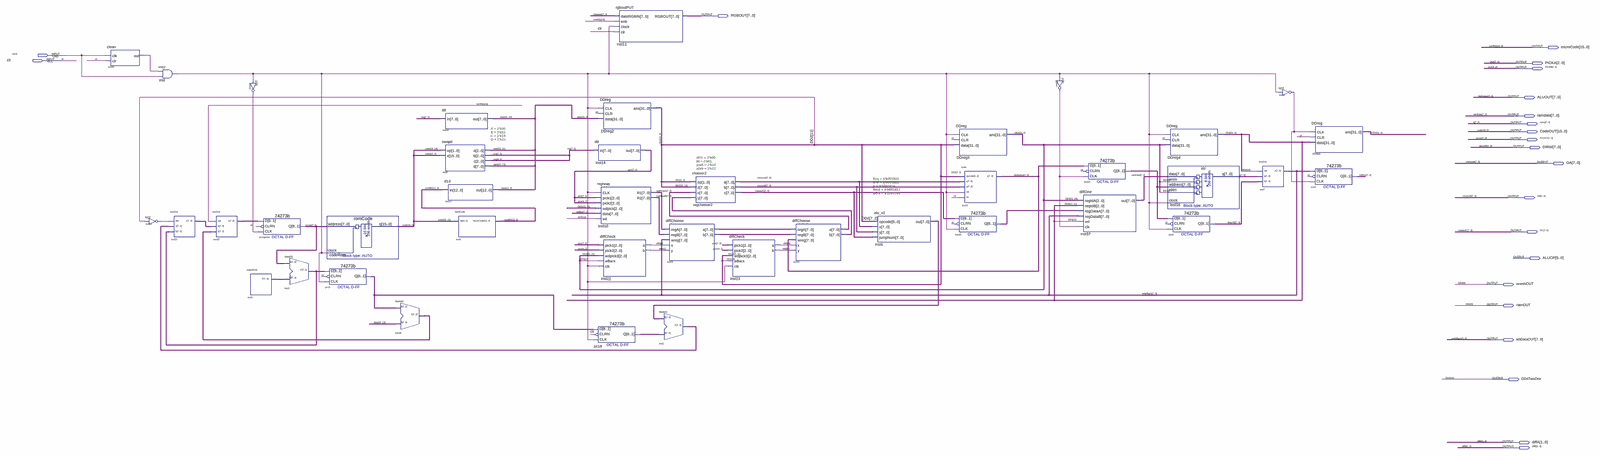
[diagram p0: schematic sheet, whole]
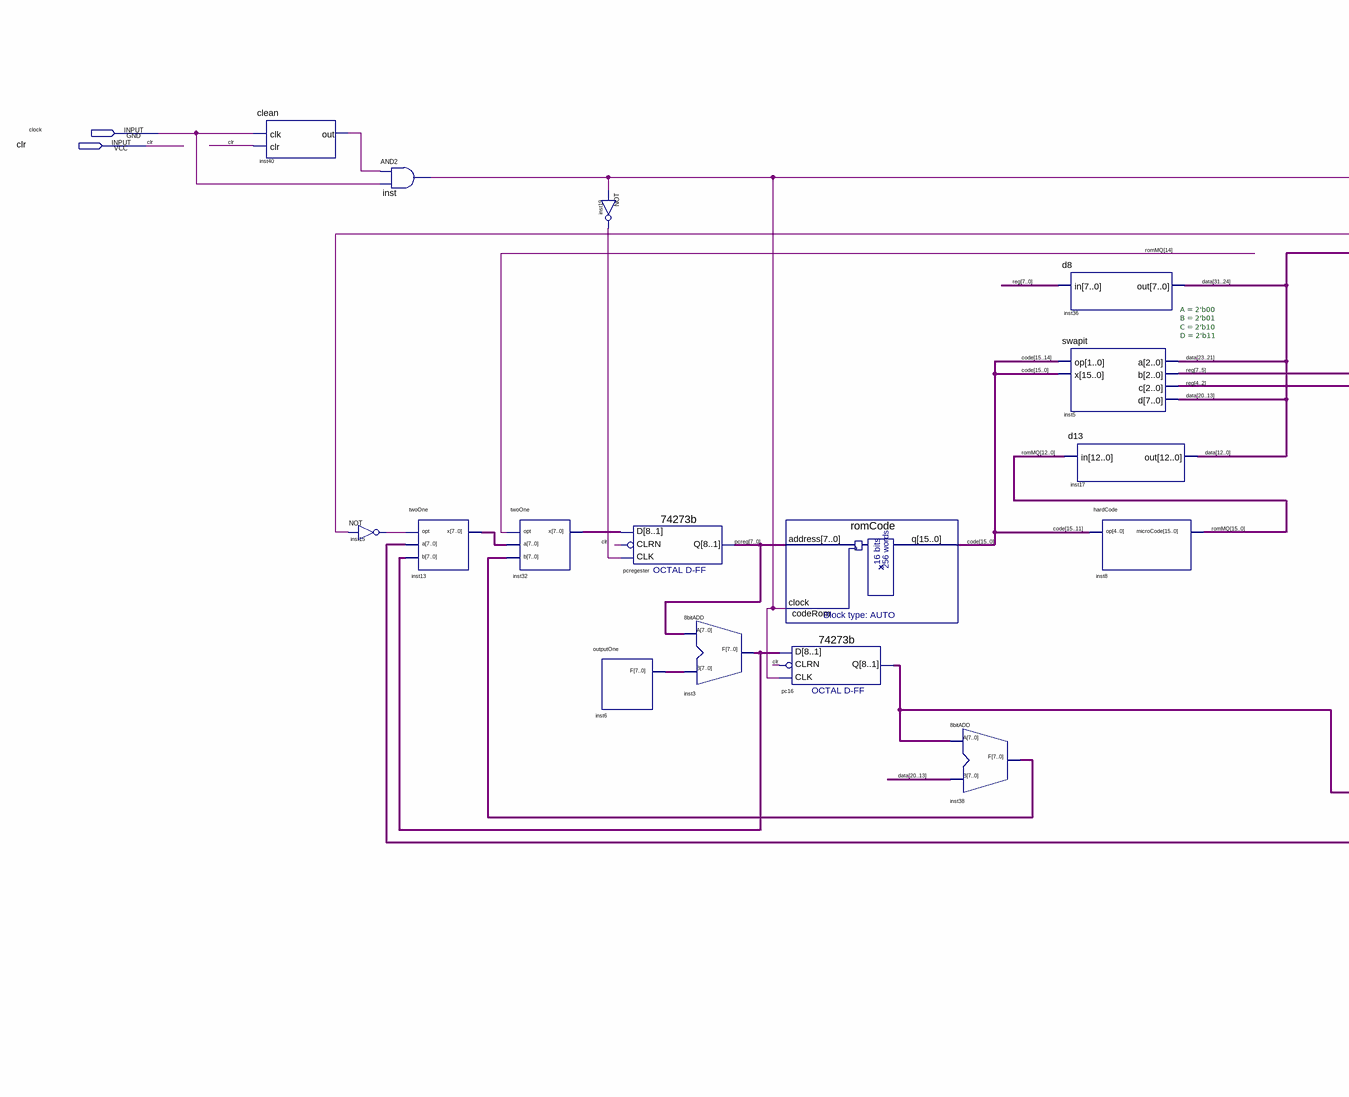
[diagram p1: schematic sheet, left part]
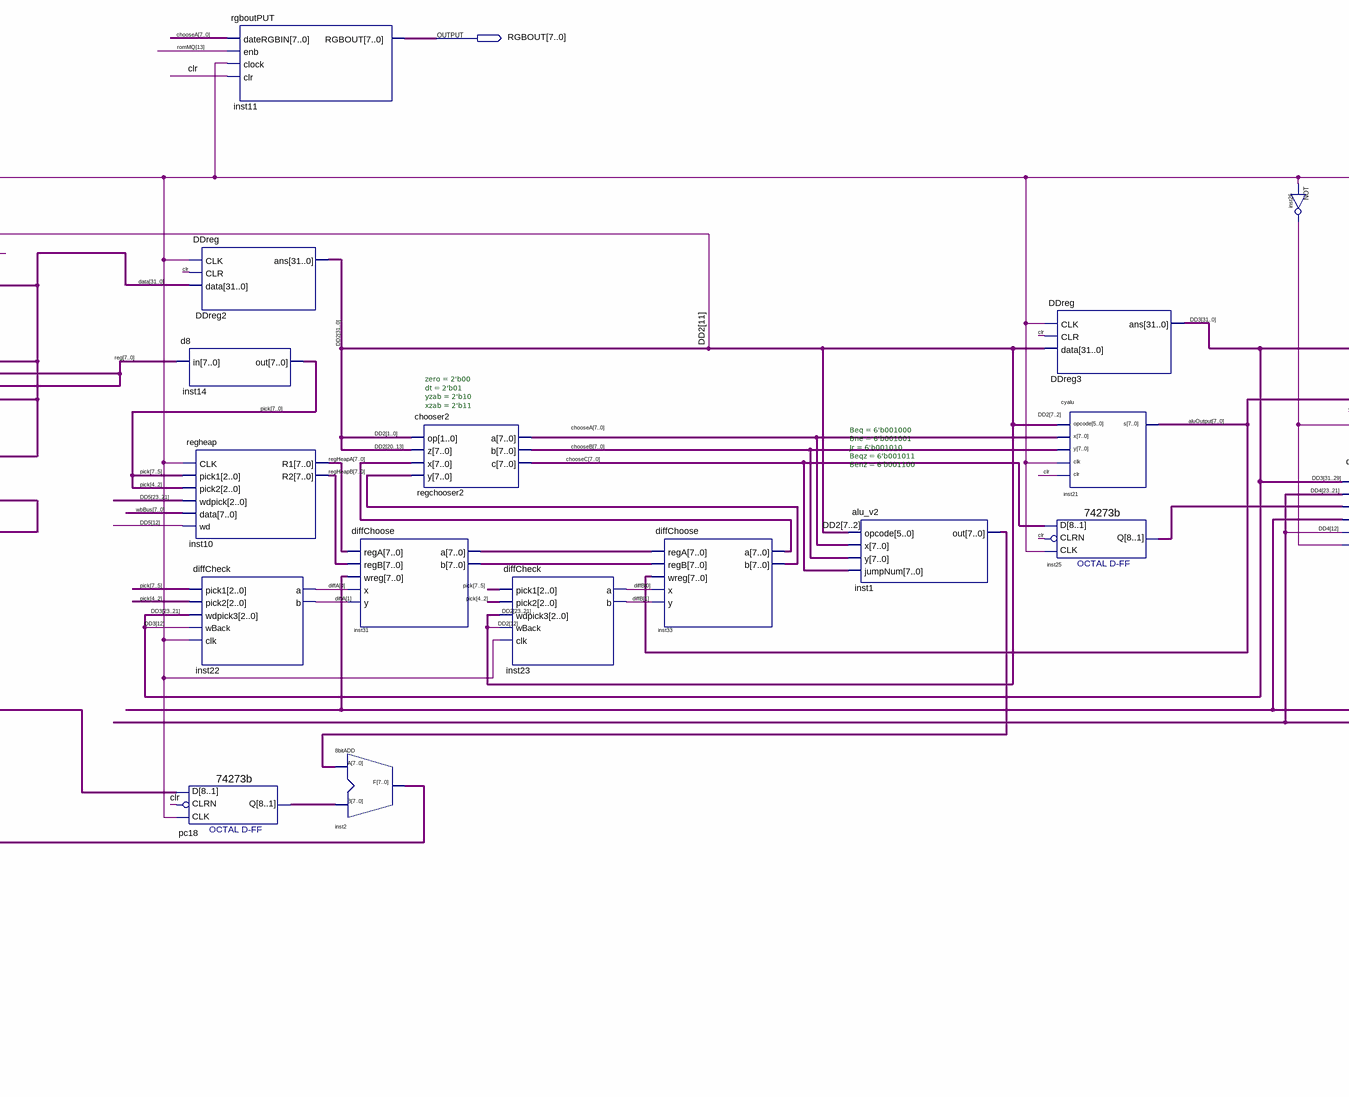
[diagram p2: schematic sheet, centre part]
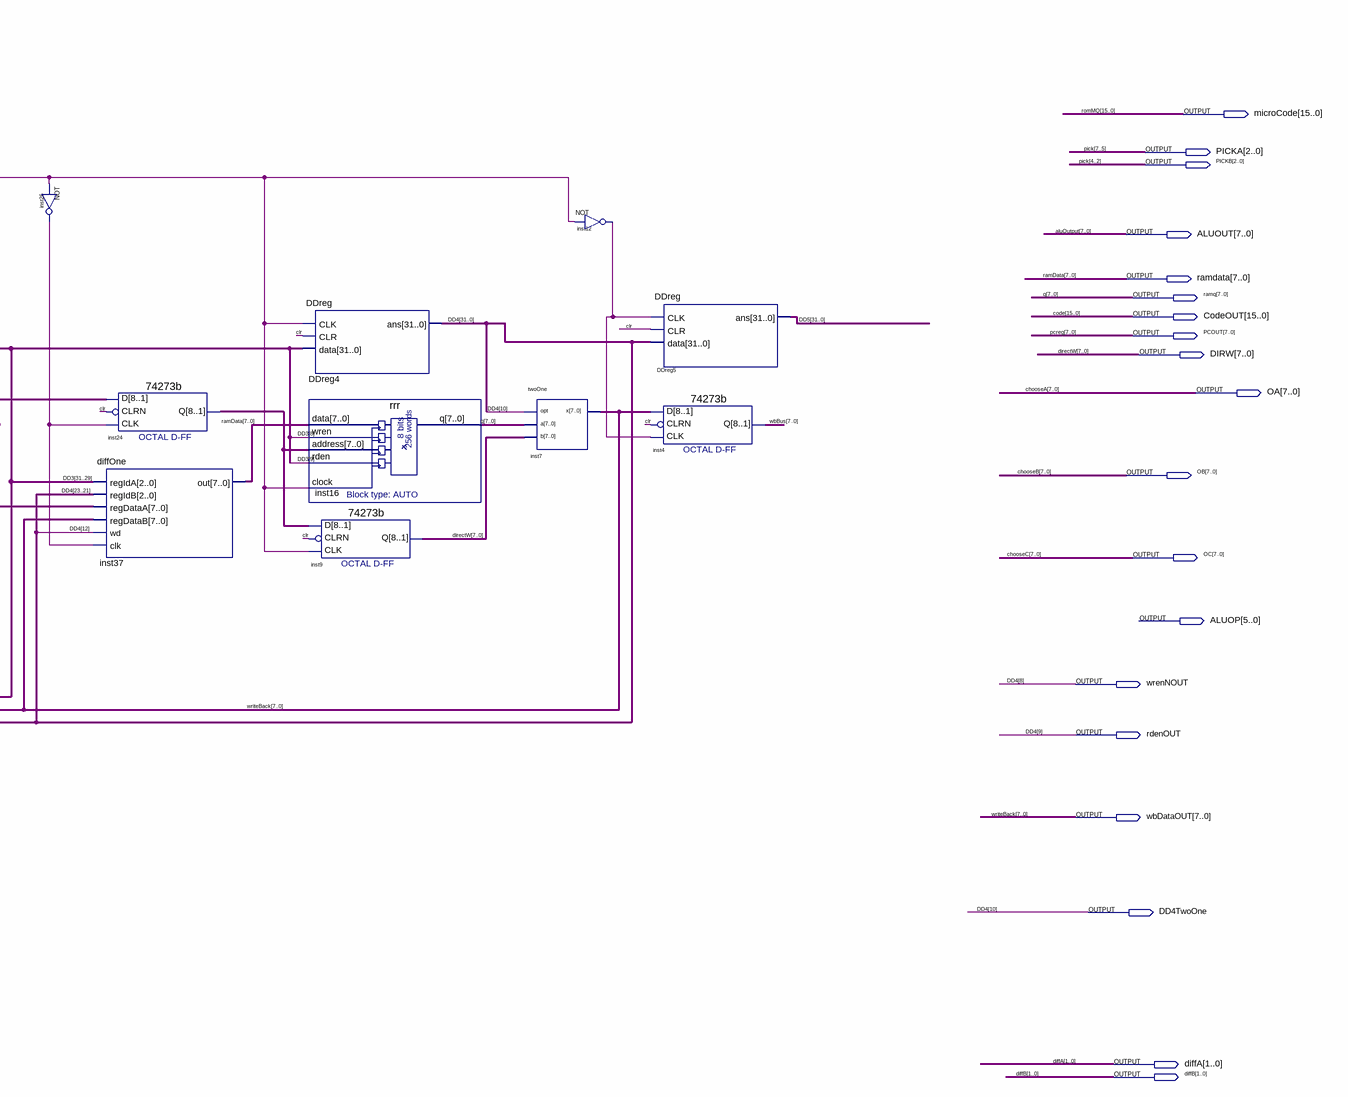
[diagram p3: schematic sheet, right part]
// Quartus schematic cpu.bdf as structural Verilog: 41 symbols, 22 pins
module cpu (
  input  clock,
  input  clr,
  output [7:0] RGBOUT,
  output [15:0] microCode,
  output [2:0] PICKA,
  output [2:0] PICKB,
  output [7:0] ALUOUT,
  output [7:0] ramdata,
  output [7:0] ramq,
  output [15:0] CodeOUT,
  output [7:0] PCOUT,
  output [7:0] DIRW,
  output [7:0] OA,
  output [7:0] OB,
  output [7:0] OC,
  output [5:0] ALUOP,
  output wrenNOUT,
  output rdenOUT,
  output [7:0] wbDataOUT,
  output DD4TwoOne,
  output [1:0] diffA,
  output [1:0] diffB
);

  wire inst12_out, inst15_out, inst19_out, inst26_out, inst40_out, inst_out;
  wire [1:0] pick;
  wire [7:0] inst1_out, inst2_f, inst3_f, inst6_f, inst13_x, inst24_q, inst25_q, inst31_a, inst31_b,
       inst32_x, inst33_a, inst33_b, inst38_f, pc16_q, pc18_q, \reg , regHeapA, regHeapB, wbBus;
  wire [31:0] data, DD2, DD3, DD4, DD5;

  clean inst40 (.clk(clock), .clr(clr), .out(inst40_out));
  and inst (inst_out, inst40_out, clock);
  not inst15 (inst15_out, DD2[11]);
  twoOne inst13 (.opt(inst15_out), .a(inst2_f), .b(inst3_f), .x(inst13_x));
  twoOne inst32 (.opt(microCode[14]), .a(inst13_x), .b(inst38_f), .x(inst32_x));
  not inst19 (inst19_out, inst_out);
  outputOne inst6 (.F(inst6_f));
  \74273b  pcregester (.CLK(inst19_out), .D(inst32_x), .CLRN(clr), .Q(PCOUT));
  \8bitADD  inst3 (.A(PCOUT), .B(inst6_f), .F(inst3_f));
  romCode codeRom (.address(PCOUT), .clock(inst_out), .q(CodeOUT));
  \74273b  pc16 (.CLK(inst_out), .D(inst3_f), .CLRN(clr), .Q(pc16_q));
  \8bitADD  inst38 (.A(pc16_q), .B(data[20:13]), .F(inst38_f));
  d8 inst36 (.in(\reg ), .out(data[31:24]));
  swapit #(.A(2'b00), .B(2'b01), .C(2'b10), .D(2'b11)) inst5 (
    .op(CodeOUT[15:14]), .x(CodeOUT), .a(data[23:21]), .b(\reg [7:5]), .c(\reg [4:2]), .d(data[20:13]));
  d13 inst17 (.in(microCode[12:0]), .out(data[12:0]));
  hardCode inst8 (.op(CodeOUT[15:11]), .microCode(microCode));
  DDreg DDreg2 (.CLK(inst_out), .CLR(clr), .data(data), .ans(DD2));
  d8 inst14 (.in(\reg ), .out({PICKA, PICKB, pick}));
  regheap inst10 (
    .CLK(inst_out), .pick1(PICKA), .pick2(PICKB), .wdpick(DD5[23:21]), .data(wbBus), .wd(DD5[12]),
    .R1(regHeapA), .R2(regHeapB));
  diffCheck inst22 (
    .pick1(PICKA), .pick2(PICKB), .wdpick3(DD3[23:21]), .wBack(DD3[12]), .clk(inst_out), .a(diffA[0]),
    .b(diffA[1]));
  \74273b  pc18 (.CLK(inst_out), .D(pc16_q), .CLRN(clr), .Q(pc18_q));
  rgboutPUT inst11 (.dateRGBIN(OA), .enb(microCode[13]), .clock(inst_out), .clr(clr), .RGBOUT(RGBOUT));
  diffChoose inst31 (
    .regA(regHeapA), .regB(regHeapB), .wreg(wbDataOUT), .x(diffA[0]), .y(diffA[1]), .a(inst31_a), .b(inst31_b));
  \8bitADD  inst2 (.A(inst1_out), .B(pc18_q), .F(inst2_f));
  chooser2 #(.zero(2'b00), .dt(2'b01), .yzab(2'b10), .xzab(2'b11)) regchooser2 (
    .op(DD2[1:0]), .z(DD2[20:13]), .x(inst33_a), .y(inst33_b), .a(OA), .b(OB), .c(OC));
  diffCheck inst23 (
    .pick1(PICKA), .pick2(PICKB), .wdpick3(DD2[23:21]), .wBack(DD2[12]), .clk(inst_out), .a(diffB[0]),
    .b(diffB[1]));
  diffChoose inst33 (
    .regA(inst31_a), .regB(inst31_b), .wreg(ALUOUT), .x(diffB[0]), .y(diffB[1]), .a(inst33_a), .b(inst33_b));
  alu_v2 #(.Beq(6'b001000), .Bne(6'b001001), .Jr(6'b001010), .Beqz(6'b001011), .Benz(6'b001100)) inst1 (
    .opcode(DD2[7:2]), .x(OA), .y(OB), .jumpNum(OC), .out(inst1_out));
  DDreg DDreg3 (.CLK(inst_out), .CLR(clr), .data(DD2), .ans(DD3));
  cyalu inst21 (.opcode(DD2[7:2]), .x(OA), .y(OB), .clk(inst_out), .clr(clr), .s(ALUOUT));
  \74273b  inst25 (.CLK(inst_out), .D(OC), .CLRN(clr), .Q(inst25_q));
  not inst26 (inst26_out, inst_out);
  \74273b  inst24 (.CLK(inst26_out), .D(ALUOUT), .CLRN(clr), .Q(inst24_q));
  diffOne inst37 (
    .regIdA(DD3[31:29]), .regIdB(DD4[23:21]), .regDataA(inst25_q), .regDataB(wbDataOUT), .wd(DD4[12]),
    .clk(inst26_out), .out(ramdata));
  DDreg DDreg4 (.CLK(inst_out), .CLR(clr), .data(DD3), .ans({DD4[31:11], DD4TwoOne, rdenOUT, wrenNOUT, DD4[7:0]}));
  rrr inst16 (.data(ramdata), .wren(DD3[8]), .address(inst24_q), .rden(DD3[9]), .clock(inst_out), .q(ramq));
  \74273b  inst9 (.CLK(inst_out), .D(inst24_q), .CLRN(clr), .Q(DIRW));
  twoOne inst7 (.opt(DD4TwoOne), .a(ramq), .b(DIRW), .x(wbDataOUT));
  not inst12 (inst12_out, inst_out);
  DDreg DDreg5 (.CLK(inst12_out), .CLR(clr), .data({DD4[31:11], DD4TwoOne, rdenOUT, wrenNOUT, DD4[7:0]}), .ans(DD5));
  \74273b  inst4 (.CLK(inst12_out), .D(wbDataOUT), .CLRN(clr), .Q(wbBus));

  // Other names for the same wires on the sheet: aluOutput[7:0] = ALUOUT; chooseA[7:0] = OA; chooseB[7:0] = OB;
  //   chooseC[7:0] = OC; code[15:0] = CodeOUT; DD4[10:8] = {DD4TwoOne, rdenOUT, wrenNOUT}; directW[7:0] = DIRW;
  //   pcreg[7:0] = PCOUT; pick[7:2] = {PICKA, PICKB}; q[7:0] = ramq; romMQ[15:0] = microCode;
  //   writeBack[7:0] = wbDataOUT
endmodule
